# Altium project Project_1C.PrjPcb
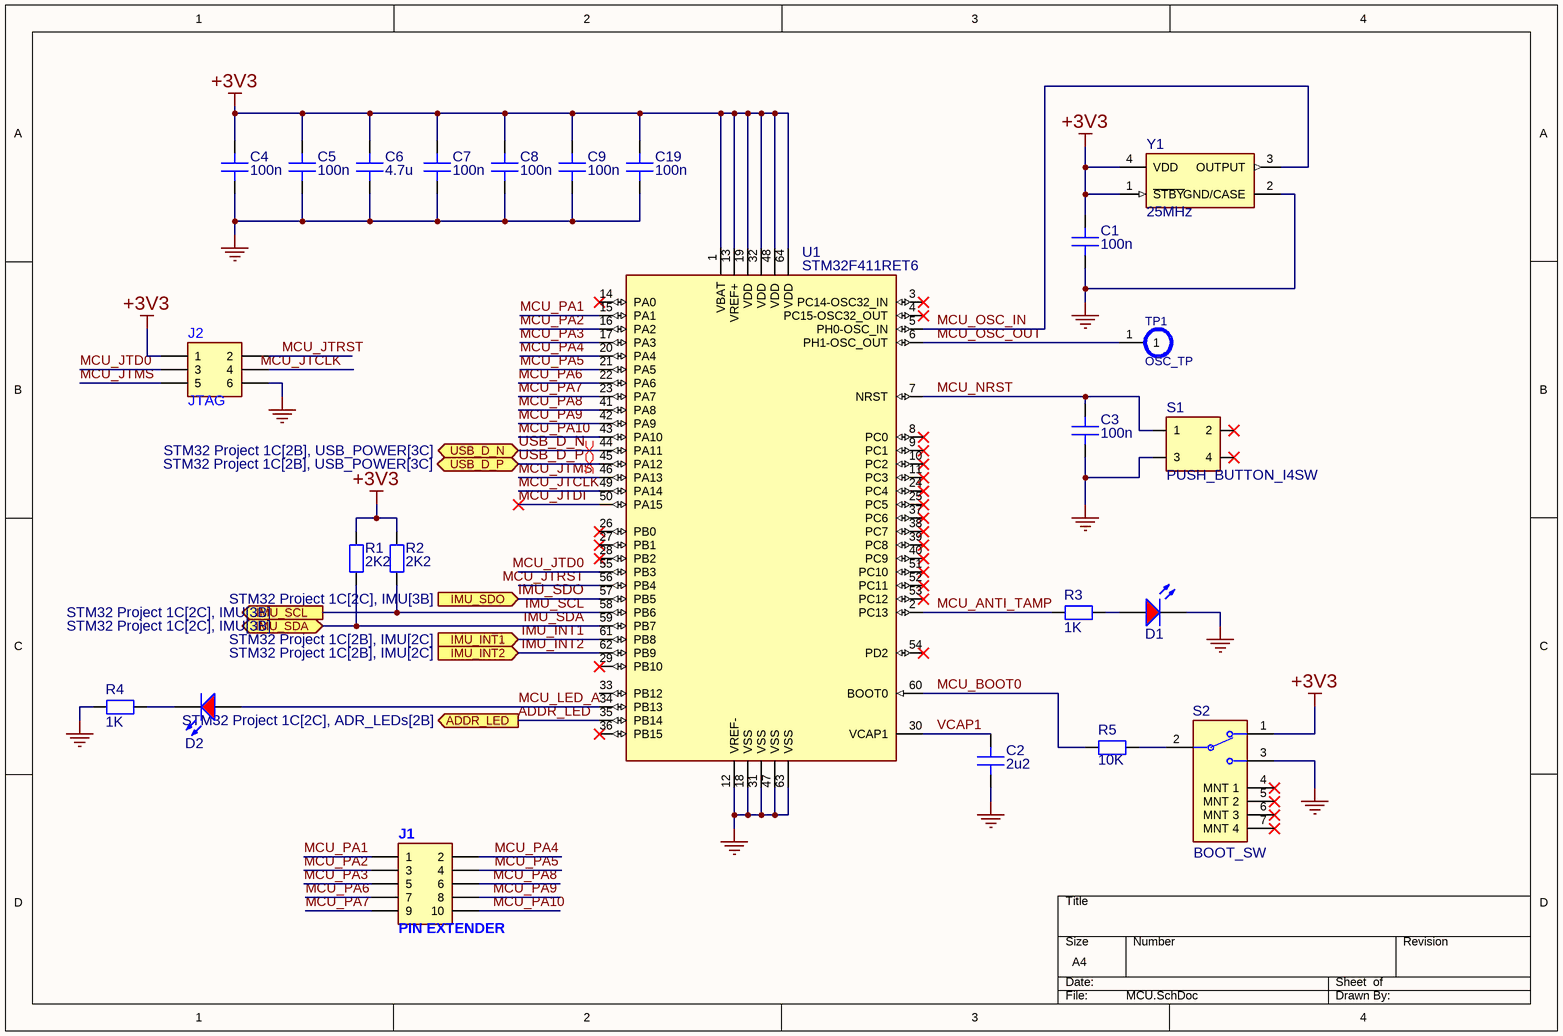
[diagram p0: MCU.SchDoc]
2 sheets, 29 parts. Net scope: flat (ports and power ports of the same name join across sheets).
Board file: STM32 Project 1C.PcbDoc
Sheets:
  MCU.SchDoc
  IMU.SchDoc

## Sheet MCU.SchDoc: MCU Schematic
size A4; Date: 25 July 2024; Author: Ibrahim Oladepo; DrawnBy: Ibrahim Oladepo; SheetNumber: 2; SheetTotal: 5

### Parts
C1  100n  [CAP_0805]
C2  2u2  [CAP_0805]
C3  100n  [CAP_0805]
C4  100n  [CAP_0805]
C5  100n  [CAP_0805]
C6  4.7u  [CAP_0805]
C7  100n  [CAP_0805]
C8  100n  [CAP_0805]
C9  100n  [CAP_0805]
C19  100n  [CAP_0805]
D1  LED_RED_0805  [LED_RED_0805]  (value not drawn)
D2  LED_RED_0805  [LED_RED_0805]  (value not drawn)
J1  PIN EXTENDER  [10P_2x5_HEADER]
J2  JTAG  [6P_2x3_HEADER]
R1  2K2  [RES_0805]
R2  2K2  [RES_0805]
R3  1K  [RES_0805]
R4  1K  [RES_0805]
R5  10K  [RES_0805]
S1  PUSH_BUTTON_I4SW  [PUSH_BUTTON_I4SW]
S2  BOOT_SW  [SLIDE_SWITCH_SPDT]
TP1  OSC_TP  [TEST_POINT_SMD]  (no BOM)
U1  STM32F411RET6  [STM32F411RET6]
Y1  25MHz  [XTAL_OSCILLATOR_25MHz]

### Ports
ADDR_LED (out, see STM32 Project 1C[2C], ADR_LEDs[2B]), IMU_INT1 (in, see STM32 Project 1C[2B], IMU[2C]), IMU_INT2 (in, see STM32 Project 1C[2B], IMU[2C]), IMU_SCL (out, see STM32 Project 1C[2C], IMU[3B]), IMU_SDA (bidir, see STM32 Project 1C[2C], IMU[3B]), IMU_SDO (in, see STM32 Project 1C[2C], IMU[3B]), USB_D_N (bidir, see STM32 Project 1C[2B], USB_POWER[3C]), USB_D_P (bidir, see STM32 Project 1C[2B], USB_POWER[3C])

### Nets
+3V3: C1.2 C4.2 C5.2 C6.2 C7.2 C8.2 C9.2 C19.2 J2.1 R1.1 R2.1 S2.1 U1.1(VBAT) U1.13(VREF+) U1.19(VDD) U1.32(VDD) U1.48(VDD) U1.64(VDD) Y1.1(~{STBY}) Y1.4(VDD)
GND: C1.1 C2.1 C3.1 C4.1 C5.1 C6.1 C7.1 C8.1 C9.1 C19.1 D1.1(K) J2.6 R4.1 S1.3 S2.3 U1.12(VREF-) U1.18(VSS) U1.31(VSS) U1.47(VSS) U1.63(VSS) Y1.2(GND/CASE)
ADDR_LED: U1.35(PB14) ; port ADDR_LED
IMU_INT1: U1.61(PB8) ; port IMU_INT1
IMU_INT2: U1.62(PB9) ; port IMU_INT2
IMU_SCL: R2.2 U1.58(PB6) ; port IMU_SCL
IMU_SDA: R1.2 U1.59(PB7) ; port IMU_SDA
IMU_SDO: U1.57(PB5) ; port IMU_SDO
MCU_ANTI_TAMP: R3.1 U1.2(PC13)
MCU_BOOT0: R5.2 U1.60(BOOT0)
MCU_JTCLK: J2.4 U1.49(PA14)
MCU_JTD0: J2.3 U1.55(PB3)
MCU_JTDI: U1.50(PA15)
MCU_JTMS: J2.5 U1.46(PA13)
MCU_JTRST: J2.2 U1.56(PB4)
MCU_LED_A: D2.2(A) U1.34(PB13)
MCU_NRST: C3.2 S1.1 U1.7(NRST)
MCU_OSC_IN: U1.5(PH0-OSC_IN) Y1.3(OUTPUT)
MCU_OSC_OUT: TP1.1 U1.6(PH1-OSC_OUT)
MCU_PA1: J1.1 U1.15(PA1)
MCU_PA2: J1.3 U1.16(PA2)
MCU_PA3: J1.5 U1.17(PA3)
MCU_PA4: J1.2 U1.20(PA4)
MCU_PA5: J1.4 U1.21(PA5)
MCU_PA6: J1.7 U1.22(PA6)
MCU_PA7: J1.9 U1.23(PA7)
MCU_PA8: J1.6 U1.41(PA8)
MCU_PA9: J1.8 U1.42(PA9)
MCU_PA10: J1.10 U1.43(PA10)
USB_D_N: U1.44(PA11) ; port USB_D_N
USB_D_P: U1.45(PA12) ; port USB_D_P
VCAP1: C2.2 U1.30(VCAP1)
NetD1_2: D1.2(A) R3.2
NetD2_1: D2.1(K) R4.2
NetR5_1: R5.1 S2.2

Not connected (* = marked no-connect by the designer): S1 2* 4*; S2 4(MNT_1)* 5(MNT_2)* 6(MNT_3)* 7(MNT_4)*; U1 3(PC14-OSC32_IN)* 4(PC15-OSC32_OUT)* 8(PC0)* 9(PC1)* 10(PC2)* 11(PC3)* 14(PA0)* 24(PC4)* 25(PC5)* 26(PB0)* 27(PB1)* 28(PB2)* 29(PB10)* 33(PB12) 36(PB15)* 37(PC6)* 38(PC7)* 39(PC8)* 40(PC9)* 51(PC10)* 52(PC11)* 53(PC12)* 54(PD2)*

### Layout directives
differential pair: USB_D_N, USB_D_P

### Library data of the parts
C1-C9 C19 = CAP_0805: Capacitor SMD 0805 Generic; Manufacturer: *; Manufacturer Part Number: *; Tolerance: *; Voltage Rating: *; Dielectric: *
D1 D2 = LED_RED_0805: Chip LED, Green, 2.2 V, -40 to 85 degC, 2-Pin SMD, Pb-Free, Tape and Reel; NexarPartId: 29717781; Peak Wavelength: 630nm; Wavelength: 625nm; Viewing Angle: 140°; Test Current: 20mA; Forward Voltage: 2V; Forward Current: 100mA; Lens Style: Clear, Rectangular; Color: Red; Luminous Intensity: 150mcd; Max Reverse Voltage (DC): 5V; Length: 2mm; Case Code (Imperial): 0805; RoHS: Compliant; Max Operating Temperature: 85°C; Height: 700µm; Packaging: Tape and Reel; Case/Package: 0805; REACH SVHC: Unknown; Dominant Wavelength: 625nm; Min Operating Temperature: -40°C; Case Code (Metric): 2012; Mount: Surface Mount; Width: 1.25mm
J1 = 10P_2x5_HEADER: 10 Position SMD Pin Header 2x5
J2 = 6P_2x3_HEADER: Male Header, Pitch 2.54 mm, 2 x 3 Position, Height 8.13 mm, -65 to 125 degC, RoHS, Tube; Max Supply Voltage: 5.5 V; Min Supply Voltage: 4.5 V; Nominal Supply Voltage: 5 V; Min Operating Temperature: -40 degC; ComponentLink1URL: http://www.te.com/; ComponentLink2Description: Datasheet; Pins: 3; Max Operating Temperature: 150 degC; PackageDescription: Male Header, Pitch 2.54 mm, 2 x 3 Position, Height 8.13 mm; Package Quantity: 3000; PackageReference: 5-146130-2; DatasheetVersion: Oct-15; ComponentLink1Description: Manufacturer URL; Radiation Hardening: No; Mount: Surface Mount; RoHSCompliant: true; Packaging: Tape and Reel; ComponentLink2URL: http://www.te.com/commerce/DocumentDelivery/DDEController?Action=showdoc&DocId=Customer+Drawing%7F146130%7FM%7Fpdf%7FEnglish%7FENG_CD_146130_M.pdf%7F5-146130-2
R1-R5 = RES_0805: Resistor SMD 0805 Generic; Manufacturer: *; Manufacturer Part Number: *; Tolerance: *; Package Size: *; Voltage Rating: *
S1 = PUSH_BUTTON_I4SW: Korean Hroparts Elec K2-1157SP-I4SW-01 Standing paste 250gf 12V 100000 Times Without 50mA SMD Pushbutton Switches
S2 = SLIDE_SWITCH_SPDT: SWITCH SLIDE SPDT 300MA 6V; Manufacturer: *; Manufacturer Part Number: *; Max Current: 300mA; Max Voltage: 6V
TP1 = TEST_POINT_SMD: Test Point SMD Generic - for in circuit test
U1 = STM32F411RET6: ARM® Cortex®-M4 STM32F4 Microcontroller IC 32-Bit Single-Core 100MHz 512KB (512K x 8) FLASH 64-LQFP (10x10)
Y1 = XTAL_OSCILLATOR_25MHz: XTAL Oscillator 25MHz ±50ppm CMOS 3.3V 4-SMD 3.2mm x 2.5mm; Load Capacitance: 15pF; Min Supply Voltage: 3.135V; Max Supply Voltage: 3.465V; Max Supply Current: 13mA; Max Operating Temperature: 85°C; Termination: SMD/SMT; Operating Frequency: 25 MHz; Height: 0.047inch; Frequency: 25MHz; Mount: Surface Mount; Number of Pins: 4; Length: 3.2mm; Packaging: Tape and Reel; Frequency Stability: 50ppm; Series: ASE; Radiation Hardening: No; Package Quantity: 1000; Width: 2.5mm; Min Operating Temperature: -40°C; Lead Free: Lead Free; Case/Package: SMD/SMT; Depth: 2.5mm; Operating Supply Voltage: 3.3V

## Sheet IMU.SchDoc
size A4; SheetNumber: 3; SheetTotal: 5
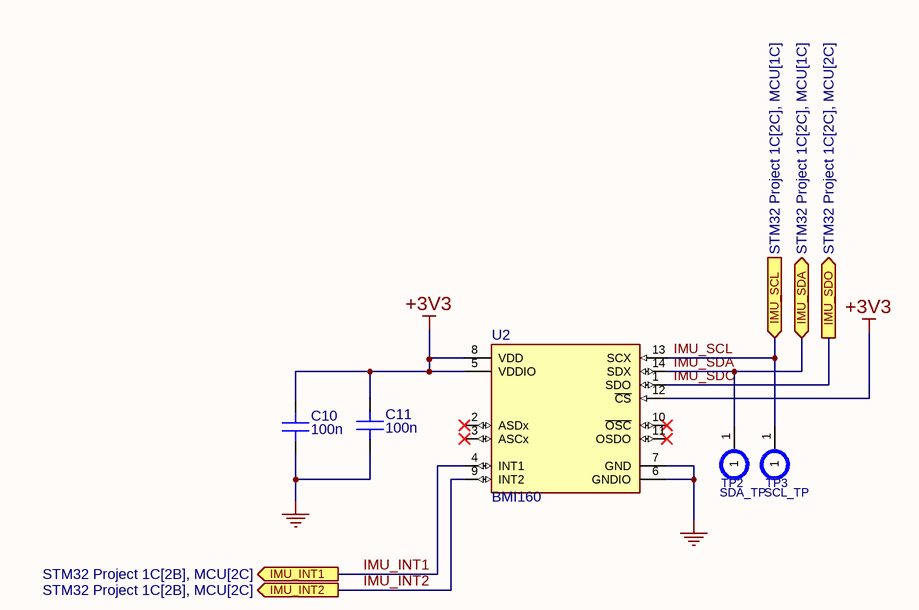
[diagram p1: IMU.SchDoc]

### Parts
C10  100n  [CAP_0805]
C11  100n  [CAP_0805]
TP2  SDA_TP  [TEST_POINT_SMD]  (no BOM)
TP3  SCL_TP  [TEST_POINT_SMD]  (no BOM)
U2  BMI160  [BMI160]

### Ports
IMU_INT1 (out, see STM32 Project 1C[2B], MCU[2C]), IMU_INT2 (out, see STM32 Project 1C[2B], MCU[2C]), IMU_SCL (in, see STM32 Project 1C[2C], MCU[1C]), IMU_SDA (bidir, see STM32 Project 1C[2C], MCU[1C]), IMU_SDO (out, see STM32 Project 1C[2C], MCU[2C])

### Nets
+3V3: C10.2 C11.2 U2.5(VDDIO) U2.8(VDD) U2.12(~{CS})
GND: C10.1 C11.1 U2.6(GNDIO) U2.7(GND)
IMU_INT1: U2.4(INT1) ; port IMU_INT1
IMU_INT2: U2.9(INT2) ; port IMU_INT2
IMU_SCL: TP3.1 U2.13(SCX) ; port IMU_SCL
IMU_SDA: TP2.1 U2.14(SDX) ; port IMU_SDA
IMU_SDO: U2.1(SDO) ; port IMU_SDO

Not connected (* = marked no-connect by the designer): U2 2(ASDx)* 3(ASCx)* 10(~{OSC})* 11(OSDO)*

### Library data of the parts
C10 C11 = CAP_0805: Capacitor SMD 0805 Generic; Manufacturer: *; Manufacturer Part Number: *; Tolerance: *; Voltage Rating: *; Dielectric: *
TP2 TP3 = TEST_POINT_SMD: as TP1 on sheet MCU
U2 = BMI160: IMU ACCEL/GYRO I2C/SPI 14LGA; Sensor Type: Accelerometer; Output Type: SPI; Mount: Surface Mount; Max Operating Temperature: 85°C; Case/Package: LGA; Min Operating Temperature: -40°C; Packaging: Cut Tape; Lead Free: Lead Free

## Nets that join several sheets
+3V3: MCU (20 pins), IMU (5 pins)
GND: MCU (21 pins), IMU (C10.1 C11.1 U2.6 U2.7)
IMU_INT1: MCU (U1.61), IMU (U2.4)
IMU_INT2: MCU (U1.62), IMU (U2.9)
IMU_SCL: MCU (R2.2 U1.58), IMU (TP3.1 U2.13)
IMU_SDA: MCU (R1.2 U1.59), IMU (TP2.1 U2.14)
IMU_SDO: MCU (U1.57), IMU (U2.1)